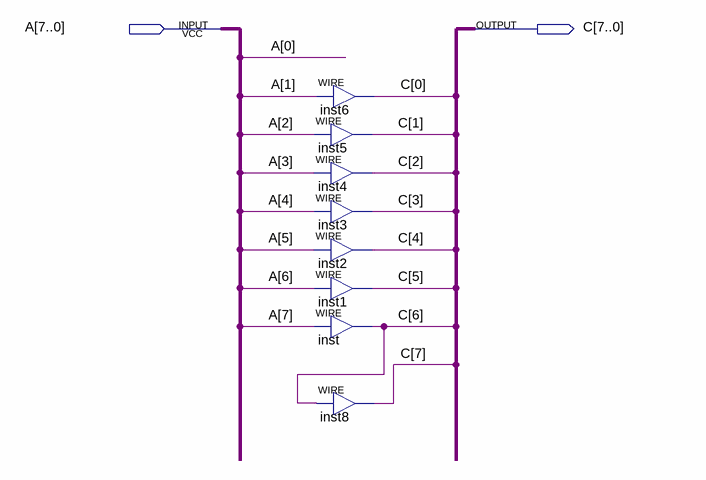
[diagram p0: schematic sheet]
// Quartus schematic SHRA.bdf as structural Verilog: 8 symbols, 2 pins
module SHRA (
  input  [7:0] A,
  output [7:0] C
);

  assign C[0] = A[1];  // WIRE inst6
  assign C[1] = A[2];  // WIRE inst5
  assign C[2] = A[3];  // WIRE inst4
  assign C[3] = A[4];  // WIRE inst3
  assign C[4] = A[5];  // WIRE inst2
  assign C[5] = A[6];  // WIRE inst1
  assign C[6] = A[7];  // WIRE inst
  assign C[7] = C[6];  // WIRE inst8
endmodule
